# Altium project PCB_Project_1.PrjPcb
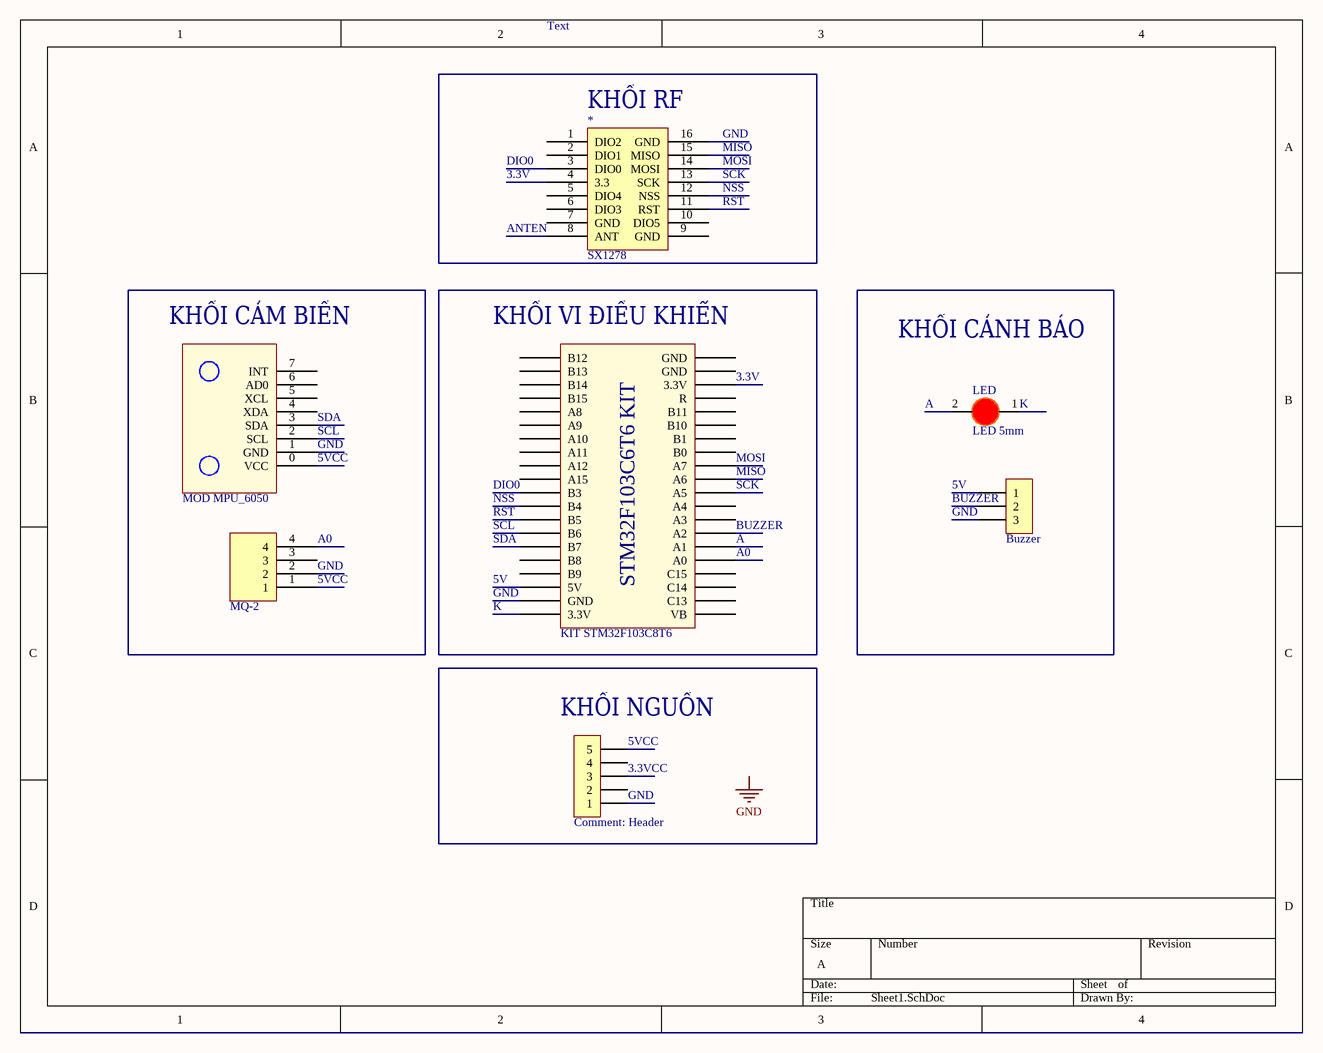
[diagram p0: Sheet1.SchDoc]
2 sheets, 7 parts. Net scope: global (net labels, ports and power ports of the same name join across sheets).
Board file: PCB1.PcbDoc
Sheets:
  Sheet1.SchDoc
  Sheet3.SchDoc

## Sheet Sheet1.SchDoc
size A; SheetNumber: 1; SheetTotal: 2

### Parts
(Parts that share a designator on the sheet are numbered #1, #2 ... from top to bottom, then left to right.)
#1  MOD MPU_6050  [MOD MPU-6050]
#2  KIT STM32F103C8T6  [STM32F103 KIT]
#3  Header  [Header 5P DC 2.54]
*  SX1278  [DIP16 - duplicate]
B  Buzzer  [Header 3P DC 2.54]
LED  LED 5mm  [LED-5MM-RED]
Sensor  MQ-2  [CON4_100_S4B-XH-A_TH_RA]

### Nets

Not connected (* = marked no-connect by the designer): #1 0(VCC) 1(GND) 2(SCL) 3(SDA) 4(XDA) 5(XCL) 6(AD0) 7(INT); #2 1(B12) 2(B13) 3(B14) 4(B15) 5(A8) 6(A9) 7(A10) 8(A11) 9(A12) 10(A15) 11(B3) 12(B4) 13(B5) 14(B6) 15(B7) 16(B8) 17(B9) 18(5V) 19(GND) 20(3.3V) 21(VB) 22(C13) 23(C14) 24(C15) 25(A0) 26(A1) 27(A2) 28(A3) 29(A4) 30(A5) 31(A6) 32(A7) 33(B0) 34(B1) 35(B10) 36(B11) 37(R) 38(3.3V) 39(GND) 40(GND); #3 1 2 3 4 5; * 1(DIO2) 2(DIO1) 3(DIO0) 4(3.3) 5(DIO4) 6(DIO3) 7(GND) 8(ANT) 9(GND) 10(DIO5) 11(RST) 12(NSS) 13(SCK) 14(MOSI) 15(MISO) 16(GND); B 1 2 3; LED 1(A) 2(K); Sensor 1 2 3 4

### Notes on the sheet
- Text
- (near *) KHỐI RF
- DIO0
- 3.3V
- GND
- MISO
- MOSI
- SCK
- (near *) ANTEN
- NSS
- RST
- KHỐI CẢM BIẾN
- KHỐI VI ĐIỀU KHIỂN
- KHỐI CẢNH BÁO
- SDA
- SCL
- (near LED) A
- (near LED) K
- 5VCC
- (near B) 5V
- (near B) BUZZER
- (near B) GND
- (near Sensor) A0
- (near Sensor) GND
- (near Sensor) 5VCC
- 5V
- A0
- BUZZER
- A
- K
- KHỐI NGUỒN
- 3.3VCC
- Labels drawn without touching a wire or pin: GND
- (in symbol STM32f103 Bluepill) STM32F103C6T6 KIT

### Library data of the parts
#2 = STM32f103 Bluepill: KIT STM32F103C8T6 Bluepill
#3 = Header 5P 2.54 Duc Cong: Cắm; Ten_Linh_Kien: Header 5P XH2.54-5P Đực Cong; Don_Vi: Con; Ma_Hang: MH001308
* = Component_1
B = Header 3P 2.54 Duc Cong: Cắm; Ten_Linh_Kien: Header 3P XH2.54-3P Đực Cong; Don_Vi: Con; Ma_Hang: MH001302; Chung_Loai: Cắm
LED = LED 5mm Do: Cắm; Don_Vi: Con; Ma_Hang: MH008967; Ten_Linh_Kien: Led 5MM Phủ Đỏ (1000c); Ghi_Chu: *; Kieu_Chan: *; Chung_Loai: Cắm
Sensor = CON-PLG_4X1-100-RA-TH: 4 Pins, 1 Row 2.54mm Pitch, right angle Connector, male; Manufacturer: Wurth Electronics; Manufacturer Part Number: S4B-XH-A-1(LF)(SN); Mating Part Number: XHP-4; Crimp Part Number: ASXHSXH22K51; Alternate Part Number-1: NA; Case/Package: TH-CON; Supplier-1: LCSC; Supplier Part Number-1: S4B-XH-A

## Sheet Sheet3.SchDoc
size A; SheetNumber: 2; SheetTotal: 2